# Altium schematic sheet TMP112_Sensor.SchDoc: =SheetTitle
size A4; SheetTitle: Board Temperature Sensor; DrawnBy: Samyar Sadat Akhavi
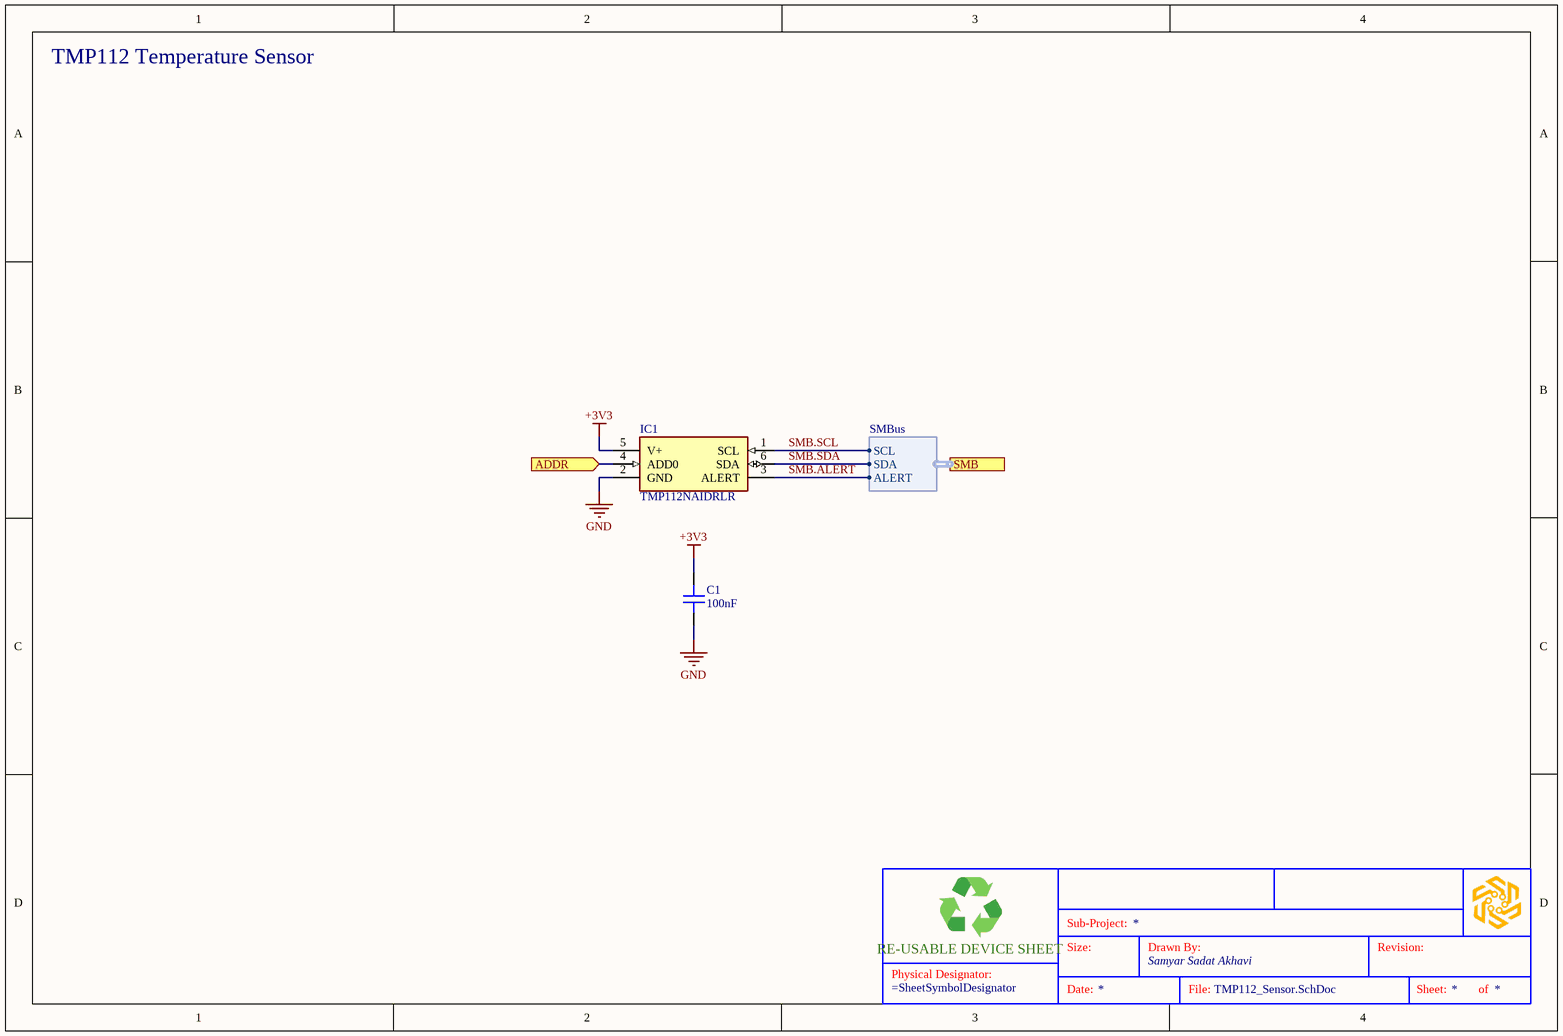
[diagram p0: TMP112_Sensor.SchDoc]

## Parts
(Parts that share a designator on the sheet are numbered #1, #2 ... from top to bottom, then left to right.)
?  (no value)  (graphical)
C1  100nF  [CAP 0603_1608]
GRAPH?#1  SGR-STDDSM  (value not drawn)  (graphical)
GRAPH?#2  SGR-STDSDES  (value not drawn)  (graphical)
IC1  TMP112NAIDRLR  [SOTFL50P160X60-6N]

## Ports
ADDR (in, see Charger_Input[1C], INA236_Sensor[3B]), SMB (harness SMBus, see Charger_Input[1C], Battery_Input[4A], Charger_Input[1C], INA236_Sensor[3B], VBAT_Output[3B])

## Harnesses
SMBus: SDA, SCL, ALERT

## Nets
+3V3: C1.1 IC1.5(V+)
GND: C1.2 IC1.2(GND)
ADDR: IC1.4(ADD0) ; port ADDR
SMB.ALERT: IC1.3(ALERT) ; port SMB.ALERT
SMB.SCL: IC1.1(SCL) ; port SMB.SCL
SMB.SDA: IC1.6(SDA) ; port SMB.SDA

## Notes on the sheet
- TMP112 Temperature Sensor
- Sub-Project:
- Size:
- Drawn By:
- Revision:
- Date:
- File:
- Sheet:
- of
- (in symbol SGR-STDDSM) RE-USABLE DEVICE SHEET
- (in symbol SGR-STDSDES) Physical Designator:

## Library data of the parts
? = SGR-STDTBSA4: STANDARD SCHEMATICS TITLE BLOCK
C1 = GEN-CC100NT10V50KX7R603: GENERIC 0603 MLC CAPACITOR; Tolerance: ±10%; Voltage: 50V; Dielectric: X7R; Part Number: GEN-CC100NT10V50KX7R603; Value: 100nF
GRAPH?#1 = SGR-STDDSM: STANDARD DEVICE SHEET MARKING; Part Number: SGR-STDDSM
GRAPH?#2 = SGR-STDSDES: STANDARD SHEET SYMBOL DESIGNATOR MARKING; Part Number: SGR-STDSDES
IC1 = TMP112NAIDRLR: SENSOR DIGITAL -40C-125C SOT563; Manufacturer: Texas Instruments; Part Number: TMP112NAIDRLR; Supplier 1: DigiKey; Supplier Part Number 1: 296-50015-1-ND